# EAGLE design sanguish 3a pour (EAGLE 6.2)
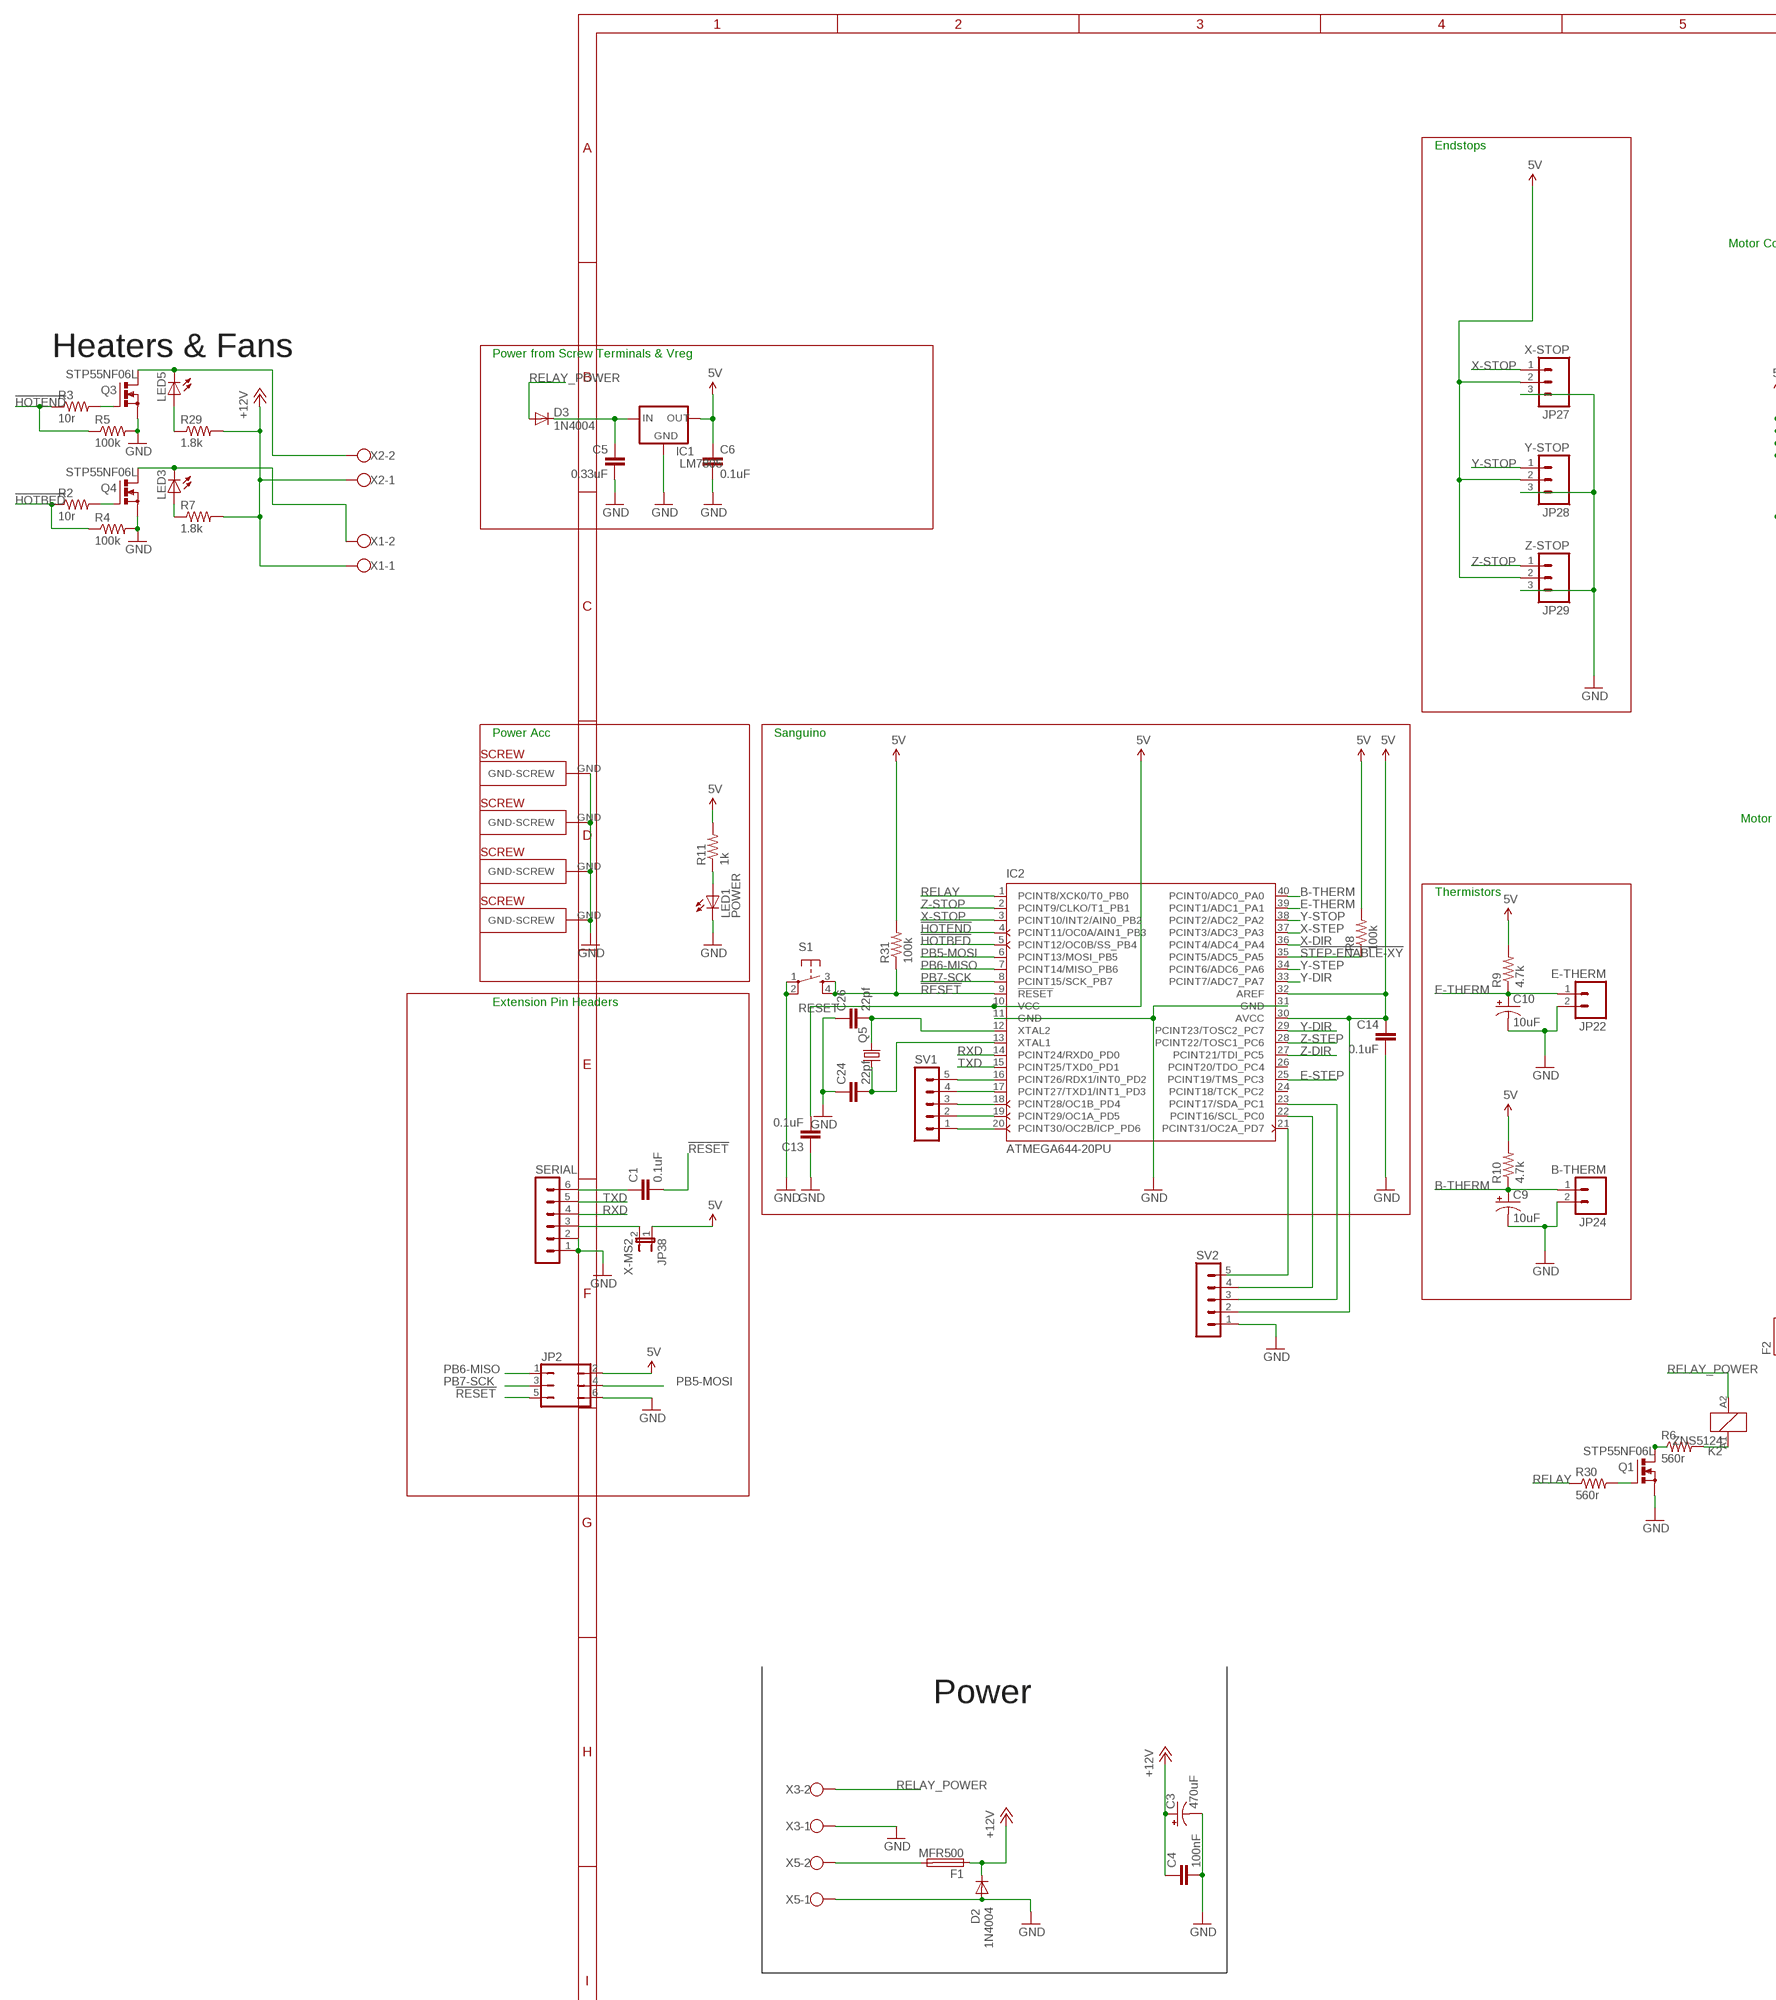
[diagram p0: schematic, sheet 1, part 1 of 2]
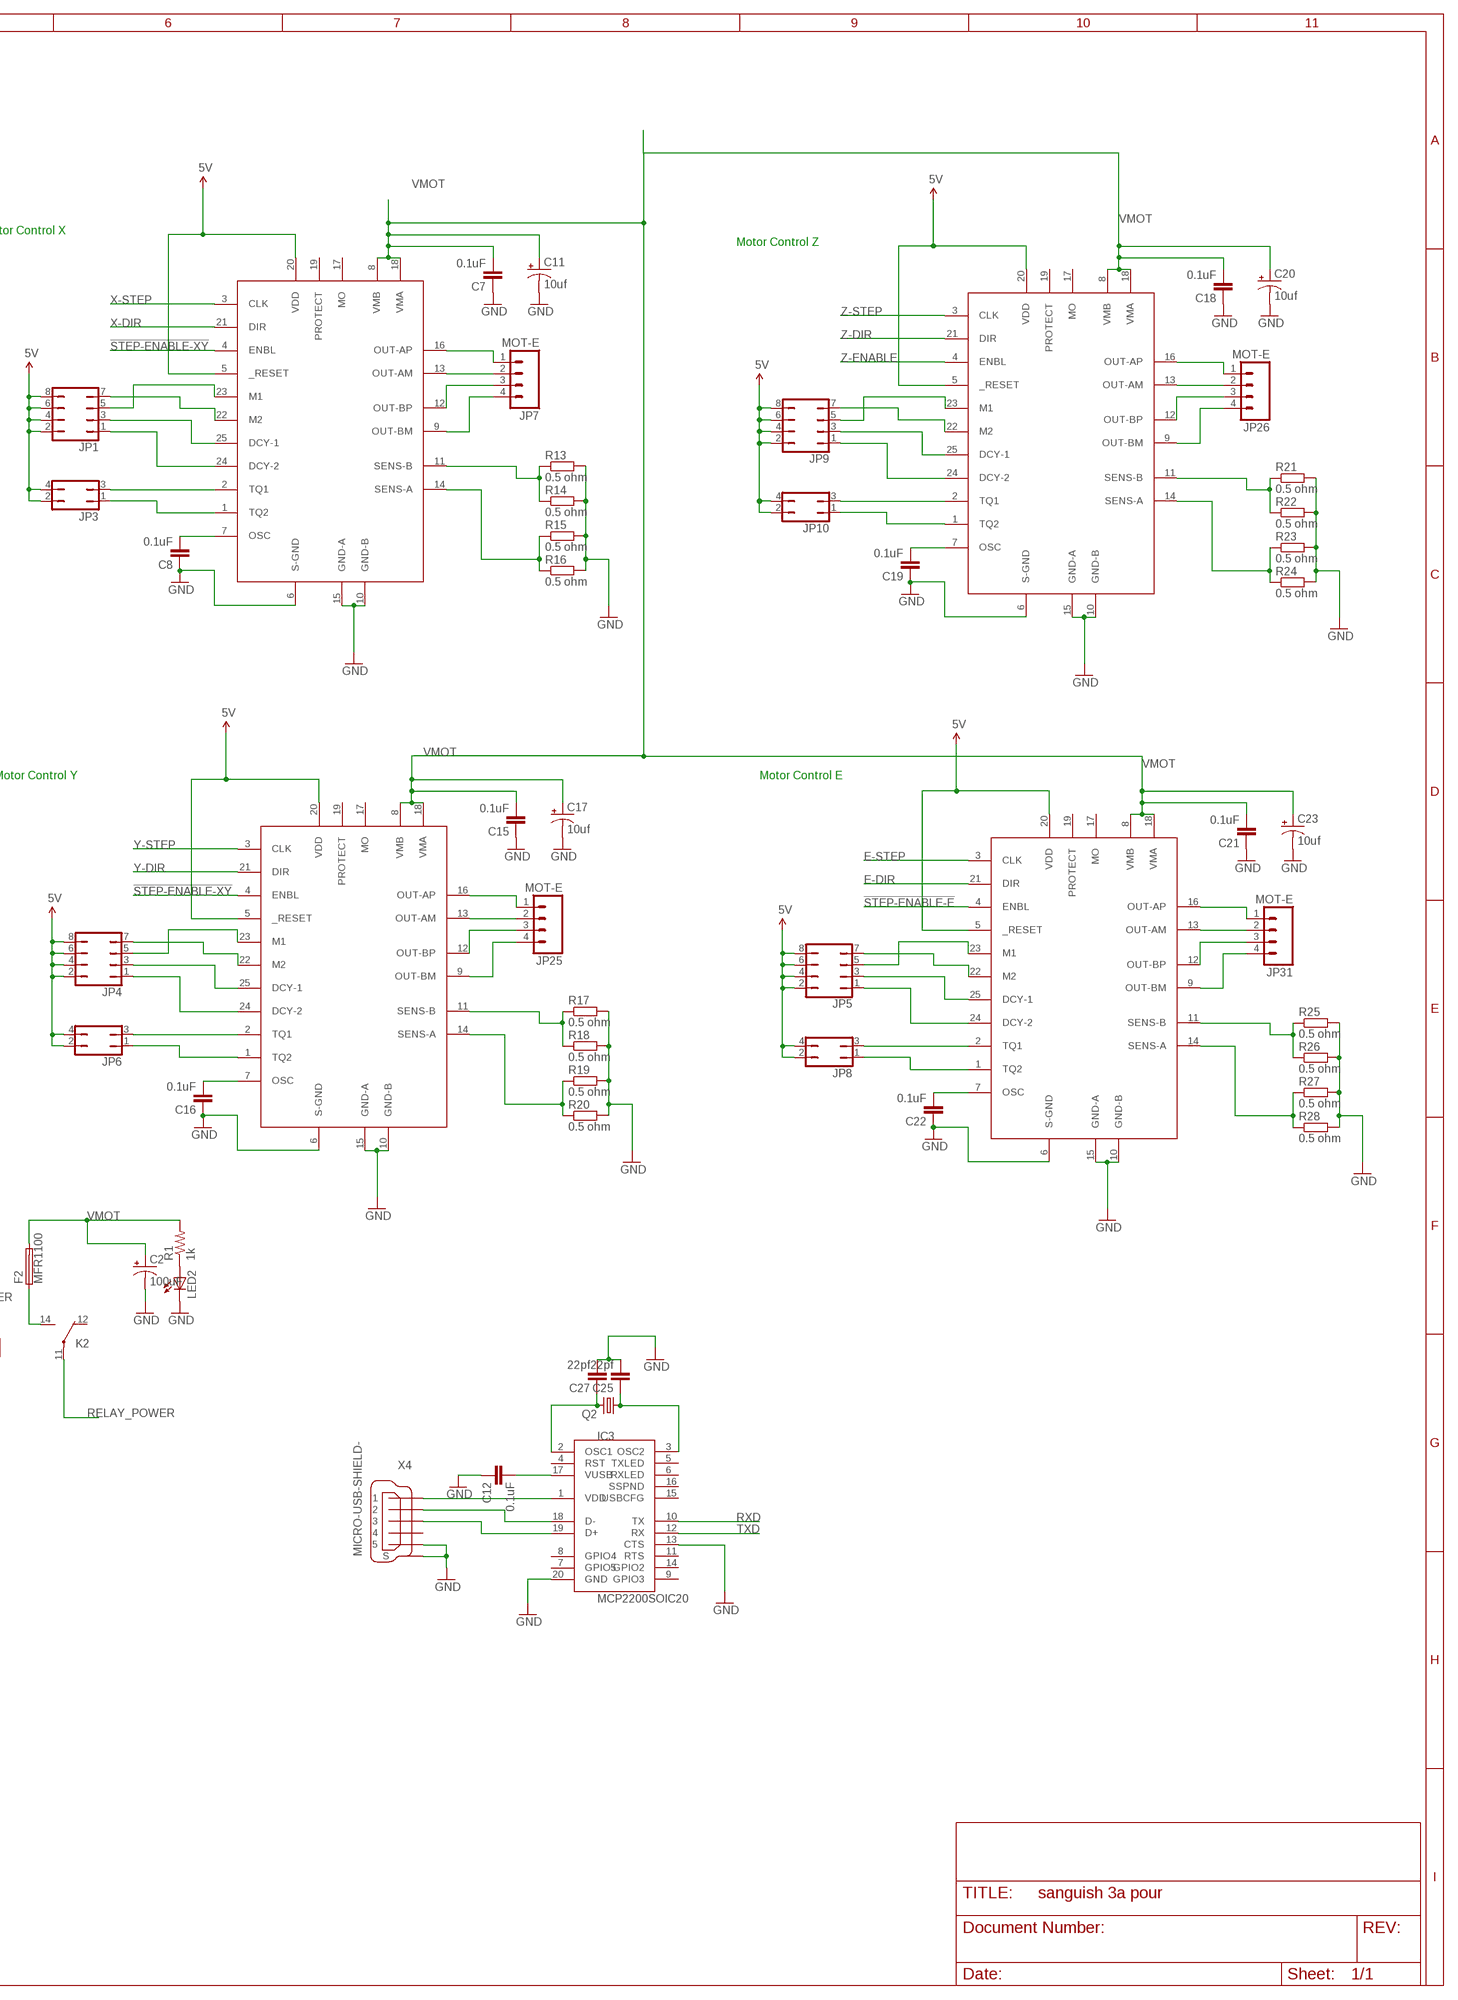
[diagram p1: schematic, sheet 1, part 2 of 2]

## Parts
C1  0.1uF  CAPPTH2  [CAP-PTH-SMALL2]
C2  100uF  CAP_POLPTH2  [CPOL-RADIAL-10UF-25V]
C3  470uF  CPOL-USE3.5-8  [E3,5-8]
C4  100nF  C2,5-3  [C2.5-3]
C5  0.33uF  CAPPTH2  [CAP-PTH-SMALL2]
C6  0.1uF  CAPPTH2  [CAP-PTH-SMALL2]
C7  0.1uF  CAPPTH2  [CAP-PTH-SMALL2]
C8  0.1uF  CAPPTH2  [CAP-PTH-SMALL2]
C9  10uF  CAP_POLPTH2  [CPOL-RADIAL-10UF-25V]
C10  10uF  CAP_POLPTH2  [CPOL-RADIAL-10UF-25V]
C11  10uf  CAP_POLPTH1  [CPOL-RADIAL-100UF-25V]
C12  0.1uF  CAPPTH2  [CAP-PTH-SMALL2]
C13  0.1uF  CAPPTH2  [CAP-PTH-SMALL2]
C14  0.1uF  CAPPTH2  [CAP-PTH-SMALL2]
C15  0.1uF  CAPPTH2  [CAP-PTH-SMALL2]
C16  0.1uF  CAPPTH2  [CAP-PTH-SMALL2]
C17  10uf  CAP_POLPTH1  [CPOL-RADIAL-100UF-25V]
C18  0.1uF  CAPPTH2  [CAP-PTH-SMALL2]
C19  0.1uF  CAPPTH2  [CAP-PTH-SMALL2]
C20  10uf  CAP_POLPTH1  [CPOL-RADIAL-100UF-25V]
C21  0.1uF  CAPPTH2  [CAP-PTH-SMALL2]
C22  0.1uF  CAPPTH2  [CAP-PTH-SMALL2]
C23  10uf  CAP_POLPTH1  [CPOL-RADIAL-100UF-25V]
C24  22pf  CAPPTH2  [CAP-PTH-SMALL2]
C25  22pf  CAPPTH2  [CAP-PTH-SMALL2]
C26  22pf  CAPPTH2  [CAP-PTH-SMALL2]
C27  22pf  CAPPTH2  [CAP-PTH-SMALL2]
D2  1N4004  [DO41-10]
D3  1N4004  [DO41-10]
F1  MFR500  PTCFUSE  [MFR500]
F2  MFR1100  PTCFUSEMFR1100  [MFR1100]
IC1  LM7805  V_REG_78XX  [78XXL-CUSTOM]
IC2  ATMEGA644-20PU  [DIL40]
IC3  MCP2200SOIC20  [SOIC20]
JP1  JP4Q  [JP4Q]
JP2  JP3Q  [JP3Q]
JP3  JP2Q  [JP2Q]
JP4  JP4Q  [JP4Q]
JP5  JP4Q  [JP4Q]
JP6  JP2Q  [JP2Q]
JP7  MOT-E  M04POLAR  [MOLEX-1X4]
JP8  JP2Q  [JP2Q]
JP9  JP4Q  [JP4Q]
JP10  JP2Q  [JP2Q]
JP22  E-THERM  M02PTH  [1X02]
JP24  B-THERM  M02PTH  [1X02]
JP25  MOT-E  M04POLAR  [MOLEX-1X4]
JP26  MOT-E  M04POLAR  [MOLEX-1X4]
JP27  X-STOP  M03POLAR  [MOLEX-1X3]
JP28  Y-STOP  M03POLAR  [MOLEX-1X3]
JP29  Z-STOP  M03POLAR  [MOLEX-1X3]
JP31  MOT-E  M04POLAR  [MOLEX-1X4]
JP38  X-MS2  JUMPER-2PTH  [1X02]
K2  ZNS5124  [ZN5]
LED1  POWER  LED3MM  [LED3MM]
LED2  LED3MM  [LED3MM]
LED3  LED3MM  [LED3MM]
LED5  LED3MM  [LED3MM]
Q1  STP55NF06L  IRF512  [TO220BV]
Q2  CRYSTALHC49S  [HC49/S]
Q3  STP55NF06L  IRF512  [TO220BV]
Q4  STP55NF06L  IRF512  [TO220BV]
Q5  CRYSTALHC49S  [HC49/S]
R1  1k  R-US_0207/2V  [0207/2V]
R2  10r  R-US_0207/2V  [0207/2V]
R3  10r  R-US_0207/2V  [0207/2V]
R4  100k  R-US_0207/2V  [0207/2V]
R5  100k  R-US_0207/2V  [0207/2V]
R6  560r  R-US_0207/2V  [0207/2V]
R7  1.8k  R-US_0207/2V  [0207/2V]
R8  100k  R-US_0207/2V  [0207/2V]
R9  4.7k  R-US_0207/2V  [0207/2V]
R10  4.7k  R-US_0207/2V  [0207/2V]
R11  1k  R-US_0207/2V  [0207/2V]
R13  0.5 ohm  R-EU_0207/10  [0207/10]
R14  0.5 ohm  R-EU_0207/10  [0207/10]
R15  0.5 ohm  R-EU_0207/10  [0207/10]
R16  0.5 ohm  R-EU_0207/10  [0207/10]
R17  0.5 ohm  R-EU_0207/10  [0207/10]
R18  0.5 ohm  R-EU_0207/10  [0207/10]
R19  0.5 ohm  R-EU_0207/10  [0207/10]
R20  0.5 ohm  R-EU_0207/10  [0207/10]
R21  0.5 ohm  R-EU_0207/10  [0207/10]
R22  0.5 ohm  R-EU_0207/10  [0207/10]
R23  0.5 ohm  R-EU_0207/10  [0207/10]
R24  0.5 ohm  R-EU_0207/10  [0207/10]
R25  0.5 ohm  R-EU_0207/10  [0207/10]
R26  0.5 ohm  R-EU_0207/10  [0207/10]
R27  0.5 ohm  R-EU_0207/10  [0207/10]
R28  0.5 ohm  R-EU_0207/10  [0207/10]
R29  1.8k  R-US_0207/2V  [0207/2V]
R30  560r  R-US_0207/2V  [0207/2V]
R31  100k  R-US_0207/2V  [0207/2V]
S1  RESET  TAC_SWITCHPTH  [TACTILE-PTH]
SERIAL  MA06-1  [MA06-1]
SV1  MA05-1  [MA05-1]
SV2  MA05-1  [MA05-1]
U$7  PLATED-SCREW  [PLATEDSCREW]
U$17  PLATED-SCREW  [PLATEDSCREW]
U$21  TB6560  [ZIP25]
U$37  PLATED-SCREW  [PLATEDSCREW]
U$38  PLATED-SCREW  [PLATEDSCREW]
U$43  TB6560  [ZIP25]
U$46  TB6560  [ZIP25]
X1  W237-102  [W237-102]
X2  W237-102  [W237-102]
X3  W237-102  [W237-102]
X4  MICRO-USB-SHIELD-  [10118192-0001LF]
X5  W237-102  [W237-102]
XMOT  TB6560  [ZIP25]

## Nets
5V: C6.1 C13.2 C14.1 IC1.OUT IC2.10(VCC) IC2.30(AVCC) IC2.32(AREF) JP1.2 JP1.4 JP1.6 JP1.8 JP2.2 JP3.2 JP3.4 JP4.2 JP4.4 JP4.6 JP4.8 JP5.2 JP5.4 JP5.6 JP5.8 JP6.2 JP6.4 JP8.2 JP8.4 JP9.2 JP9.4 JP9.6 JP9.8 JP10.2 JP10.4 JP27.2 JP28.2 JP29.2 JP38.1 R8.2 R9.2 R10.2 R11.2 R31.2 SV2.2 U$21.5(_RESET) U$21.20(VDD) U$43.5(_RESET) U$43.20(VDD) U$46.5(_RESET) U$46.20(VDD) XMOT.5(_RESET) XMOT.20(VDD)
!HOTBED: IC2.5(PCINT12/OC0B/SS_PB4) R2.1 R4.1
!HOTEND: IC2.4(PCINT11/OC0A/AIN1_PB3) R3.1 R5.1
!RESET: C1.2 IC2.9(!RESET) JP2.5 R31.1 S1.3 S1.4
!STEP-ENABLE-E: U$46.4(ENBL)
!STEP-ENABLE-XY: IC2.35(PCINT5/ADC5_PA5) R8.1 U$21.4(ENBL) XMOT.4(ENBL)
+12V: C3.+ C4.1 D2.C F1.1 R7.2 R29.2 X1.1 X2.1
B-THERM: C9.1(+) IC2.40(PCINT0/ADC0_PA0) JP24.1 R10.1
E-DIR: U$46.21(DIR)
E-STEP: IC2.25(PCINT19/TMS_PC3) U$46.3(CLK)
E-THERM: C10.1(+) IC2.39(PCINT1/ADC1_PA1) JP22.1 R9.1
GND [Power]: C2.2(-) C3.- C4.2 C5.2 C6.2 C7.1 C8.1 C9.2(-) C10.2(-) C11.2(-) C12.1 C13.1 C14.2 C15.1 C16.1 C17.2(-) C18.1 C19.1 C20.2(-) C21.1 C22.1 C23.2(-) C24.1 C25.2 C26.1 C27.2 D2.A IC1.GND IC2.11(GND) IC2.31(GND) IC3.13(CTS) IC3.20(GND) JP2.6 JP22.2 JP24.2 JP27.3 JP28.3 JP29.3 LED1.K(C) LED2.K(C) Q1.S Q3.S Q4.S R4.2 R5.2 R13.2 R14.2 R15.2 R16.2 R17.2 R18.2 R19.2 R20.2 R21.2 R22.2 R23.2 R24.2 R25.2 R26.2 R27.2 R28.2 S1.1 S1.2 SERIAL.1 SERIAL.2 SV2.1 U$7.GND(GND-SCREW) U$17.GND(GND-SCREW) U$21.6(S-GND) U$21.10(GND-B) U$21.15(GND-A) U$37.GND(GND-SCREW) U$38.GND(GND-SCREW) U$43.6(S-GND) U$43.10(GND-B) U$43.15(GND-A) U$46.6(S-GND) U$46.10(GND-B) U$46.15(GND-A) X3.1 X4.5 X4.M1(S) X4.M2(S) X4.M3(S) X4.M4(S) X4.M5(S) X4.M6(S) X5.1 XMOT.6(S-GND) XMOT.10(GND-B) XMOT.15(GND-A)
LED1: LED1.A R11.1
N$1: JP7.1 XMOT.16(OUT-AP)
N$2: JP25.1 U$21.16(OUT-AP)
N$3: JP7.2 XMOT.13(OUT-AM)
N$4: JP7.3 XMOT.12(OUT-BP)
N$5: JP7.4 XMOT.9(OUT-BM)
N$6: JP5.7 U$46.22(M2)
N$7: JP1.7 XMOT.22(M2)
N$8: JP1.3 XMOT.25(DCY-1)
N$9: JP1.1 XMOT.24(DCY-2)
N$10: JP10.3 U$43.2(TQ1)
N$11: JP3.1 XMOT.1(TQ2)
N$12: JP5.5 U$46.23(M1)
N$13: JP25.2 U$21.13(OUT-AM)
N$14: JP25.3 U$21.12(OUT-BP)
N$15: R13.1 R14.1 XMOT.11(SENS-B)
N$16: R15.1 R16.1 XMOT.14(SENS-A)
N$17: JP25.4 U$21.9(OUT-BM)
N$18: JP9.7 U$43.22(M2)
N$19: C8.2 XMOT.7(OSC)
N$20: JP4.7 U$21.22(M2)
N$21: JP4.3 U$21.25(DCY-1)
N$22: JP4.1 U$21.24(DCY-2)
N$23: JP9.5 U$43.23(M1)
N$24: JP8.3 U$46.2(TQ1)
N$25: JP5.3 U$46.25(DCY-1)
N$26: R17.1 R18.1 U$21.11(SENS-B)
N$27: R19.1 R20.1 U$21.14(SENS-A)
N$28: C16.2 U$21.7(OSC)
N$29: JP26.1 U$43.16(OUT-AP)
N$30: JP26.2 U$43.13(OUT-AM)
N$31: JP26.3 U$43.12(OUT-BP)
N$32: JP26.4 U$43.9(OUT-BM)
N$33: JP5.1 U$46.24(DCY-2)
N$34: JP6.3 U$21.2(TQ1)
N$35: JP8.1 U$46.1(TQ2)
N$36: JP3.3 XMOT.2(TQ1)
N$37: JP4.5 U$21.23(M1)
N$38: JP1.5 XMOT.23(M1)
N$39: JP9.3 U$43.25(DCY-1)
N$40: R21.1 R22.1 U$43.11(SENS-B)
N$41: R23.1 R24.1 U$43.14(SENS-A)
N$42: C19.2 U$43.7(OSC)
N$43: JP31.1 U$46.16(OUT-AP)
N$44: JP31.2 U$46.13(OUT-AM)
N$45: JP31.3 U$46.12(OUT-BP)
N$46: JP31.4 U$46.9(OUT-BM)
N$47: JP9.1
N$48: LED2.A R1.1
N$49: JP10.1
N$50: IC2.16(PCINT26/RDX1/INT0_PD2) SV1.5
N$51: IC2.17(PCINT27/TXD1/INT1_PD3) SV1.4
N$52: IC2.18(PCINT28/OC1B_PD4) SV1.3
N$53: IC2.19(PCINT29/OC1A_PD5) SV1.2
N$54: R25.1 R26.1 U$46.11(SENS-B)
N$55: R27.1 R28.1 U$46.14(SENS-A)
N$56: C22.2 U$46.7(OSC)
N$57: LED3.K(C) Q4.D X1.2
N$58: IC2.20(PCINT30/OC2B/ICP_PD6) SV1.1
N$59: LED5.K(C) Q3.D X2.2
N$60: Q4.G R2.2
N$61: Q3.G R3.2
N$62: IC2.21(PCINT31/OC2A_PD7)
N$63: IC2.22(PCINT16/SCL_PC0) SV2.4
N$64: LED3.A R7.1
N$65: LED5.A R29.1
N$66: Q1.D R6.1
N$67: Q1.G R30.2
N$68: C5.1 D3.C IC1.IN
N$69: IC2.23(PCINT17/SDA_PC1) SV2.3
N$70: C1.1 SERIAL.6
N$71: JP38.2 SERIAL.3
N$72: F2.1 K2.14(2:S)
N$73: K2.A1 R6.2
N$74: F1.2 X5.2
N$75: C12.2 IC3.17(VUSB)
N$76: JP6.1 U$21.1(TQ2)
N$77: IC3.1(VDD) X4.1
N$78: IC3.18(D-) X4.2
N$79: IC3.19(D+) X4.3
N$80: C26.2 IC2.12(XTAL2) Q5.2
N$81: C24.2 IC2.13(XTAL1) Q5.1
N$82: C27.1 IC3.2(OSC1) Q2.2
N$83: C25.1 IC3.3(OSC2) Q2.1
PB5-MOSI: IC2.6(PCINT13/MOSI_PB5) JP2.4
PB6-MISO: IC2.7(PCINT14/MISO_PB6) JP2.1
PB7-SCK: IC2.8(PCINT15/SCK_PB7) JP2.3
RELAY: IC2.1(PCINT8/XCK0/T0_PB0) R30.1
RELAY_POWER: D3.A K2.11(2:P) K2.A2 X3.2
RXD: IC2.14(PCINT24/RXD0_PD0) IC3.10(TX) SERIAL.4
TXD: IC2.15(PCINT25/TXD0_PD1) IC3.12(RX) SERIAL.5
VMOT: C2.1(+) C7.2 C11.1(+) C15.2 C17.1(+) C18.2 C20.1(+) C21.2 C23.1(+) F2.2 R1.2 U$21.8(VMB) U$21.18(VMA) U$43.8(VMB) U$43.18(VMA) U$46.8(VMB) U$46.18(VMA) XMOT.8(VMB) XMOT.18(VMA)
X-DIR: IC2.36(PCINT4/ADC4_PA4) XMOT.21(DIR)
X-STEP: IC2.37(PCINT3/ADC3_PA3) XMOT.3(CLK)
X-STOP: IC2.3(PCINT10/INT2/AIN0_PB2) JP27.1
Y-DIR: IC2.29(PCINT23/TOSC2_PC7) IC2.33(PCINT7/ADC7_PA7) U$21.21(DIR)
Y-STEP: IC2.34(PCINT6/ADC6_PA6) U$21.3(CLK)
Y-STOP: IC2.38(PCINT2/ADC2_PA2) JP28.1
Z-DIR: IC2.27(PCINT21/TDI_PC5) U$43.21(DIR)
Z-ENABLE: U$43.4(ENBL)
Z-STEP: IC2.28(PCINT22/TOSC1_PC6) U$43.3(CLK)
Z-STOP: IC2.2(PCINT9/CLKO/T1_PB1) JP29.1
Unconnected: IC2.24(PCINT18/TCK_PC2) IC2.26(PCINT20/TDO_PC4) IC3.4(RST) IC3.5(TXLED) IC3.6(RXLED) IC3.7(GPIO5) IC3.8(GPIO4) IC3.9(GPIO3) IC3.11(RTS) IC3.14(GPIO2) IC3.15(USBCFG) IC3.16(SSPND) K2.12(2:O) SV2.5 U$21.17(MO) U$21.19(PROTECT) U$43.1(TQ2) U$43.17(MO) U$43.19(PROTECT) U$43.24(DCY-2) U$46.17(MO) U$46.19(PROTECT) X4.4 XMOT.17(MO) XMOT.19(PROTECT)

## Notes on the sheet
- Endstops
- Motor Control X
- Motor Control Z
- Heaters & Fans | Power from Screw Terminals & Vreg
- Power Acc | Sanguino
- Motor Control Y | Motor Control E
- Thermistors
- Extension Pin Headers
- Power

## Library data of the parts
C1 C5-C8 C12-C16 C18 C19 C21 C22 C24-C27 = SparkFun:CAP: Capacitor Standard 0603 ceramic capacitor, and 0.1" leaded capacitor.
C2 C9-C11 C17 C20 C23 = SparkFun:CAP_POL: Capacitor Polarized These are standard SMD and PTH capacitors. Normally 10uF, 47uF, and 100uF in electrolytic and tantalum varieties. Always verify the external diameter of the through hole cap, it varies with capacity, voltage, and manufacturer. The EIA devices should be standard.
C3 = adafruit:CPOL-US: POLARIZED CAPACITOR, American symbol
C4 = capacitor-wima:C: CAPACITOR naming: grid - package width
D2 D3 = diode:1N4004: DIODE general purpose rectifier, 1 A
F1 F2 = RepRapjr:PTCFUSE: LITTLEFUSE Picofuse/slow Littlefuse
IC1 = SparkFun:V_REG_78XX: Voltage Regulator Standard 7805 5V regulator. IGO (Input Ground Output). Spark Fun Electronics SKU : COM-00107
IC2 = atmel:ATMEGA644-*PU: 8-bit Microcontroller with 64K Bytes In-System Programmable Flash Auto generated by make-symbol-device-package-bsdl.ulp Rev. 34 Source: http://www.atmel.com/dyn/resources/prod_documents/doc2593.pdf; MPN: ATMEGA644-20PU; OC_FARNELL: 1288340; OC_NEWARK: 23M5060
IC3 = microchip-update-2:MCP2200: USB 2.0 to UART Protocol Converter with GPIO
JP1 JP4 JP5 JP9 = jumper:JP4Q: JUMPER
JP2 = jumper:JP3Q: JUMPER
JP3 JP6 JP8 JP10 = jumper:JP2Q: JUMPER
JP7 JP25 JP26 JP31 = SparkFun:M04: Header 4 Standard 4-pin 0.1" header. Use with straight break away headers (SKU : PRT-00116), right angle break away headers (PRT-00553), swiss pins (PRT-00743), machine pins (PRT-00117), and female headers (PRT-00115). Molex polarized connector foot print use with SKU : PRT-08231 with associated crimp pins and housings.
JP22 JP24 = SparkFun:M02: Header 2 Standard 2-pin 0.1" header. Use with straight break away headers (SKU : PRT-00116), right angle break away headers (PRT-00553), swiss pins (PRT-00743), machine pins (PRT-00117), and female headers (PRT-00115). Molex polarized connector foot print use with SKU : PRT-08233 with associated crimp pins and housings.
JP27-JP29 = SparkFun:M03: Header 3 Standard 3-pin 0.1" header. Use with straight break away headers (SKU : PRT-00116), right angle break away headers (PRT-00553), swiss pins (PRT-00743), machine pins (PRT-00117), and female headers (PRT-00115). Molex polarized connector foot print use with SKU : PRT-08232 with associated crimp pins and housings.
JP38 = SparkFun:JUMPER-2: Jumper Basic 0.1" spaced jumper. Use with breakaway headers.
K2 = relay:ZNS5*: Miniature Power PCB Relay SCHRACK 1pole 10 A Source: http://www.schrack.com/.. 5847.pdf; OC_FARNELL: unknown; OC_NEWARK: unknown
LED1 = SparkFun:LED: LEDs Standard schematic elements and footprints for 5mm, 3mm, 1206, and 0603 sized LEDs. 5mm - Spark Fun Electronics SKU : COM-00529 (and others)
LED2 LED3 LED5 = led:LED: LED OSRAM: - CHIPLED LG R971, LG N971, LY N971, LG Q971, LY Q971, LO R971, LY R971 LH N974, LH R974 LS Q976, LO Q976, LY Q976 LO Q996 - Hyper CHIPLED LW Q18S LB Q993, LB Q99A, LB R99A - SideLED LS A670, LO A670, LY A670, LG A670, LP A670 LB A673, LV A673, LT A673, LW A673 LH A674 LY A675 LS A676, LA A676, LO A676, LY A676, LW A676 LS A679, LY A679, LG A679 - Hyper Micro SIDELED® LS Y876, LA Y876, LO Y876, LY Y876 LT Y87S - SmartLED LW L88C, LW L88S LB L89C, LB L89S, LG L890 LS L89K, LO L89K, LY L89K LS L896, LA L896, LO L896, LY L896 - TOPLED LS T670, LO T670, LY T670, LG T670, LP T670 LSG T670, LSP T670, LSY T670, LOP T670, LYG T670 LG T671, LOG T671, LSG T671 LB T673, LV T673, LT T673, LW T673 LH T674 LS T676, LA T676, LO T676, LY T676, LB T676, LH T676, LSB T676, LW T676 LB T67C, LV T67C, LT T67C, LS T67K, LO T67K, LY T67K, LW E67C LS E67B, LA E67B, LO E67B, LY E67B, LB E67C, LV E67C, LT E67C LW T67C LS T679, LY T679, LG T679 LS T770, LO T770, LY T770, LG T770, LP T770 LB T773, LV T773, LT T773, LW T773 LH T774 LS E675, LA E675, LY E675, LS T675 LS T776, LA T776, LO T776, LY T776, LB T776 LHGB T686 LT T68C, LB T68C - Hyper Mini TOPLED® LB M676 - Mini TOPLED Santana® LG M470 LS M47K, LO M47K, LY M47K Source: http://www.osram.convergy.de LUXEON: - LUMILED® LXK2-PW12-R00, LXK2-PW12-S00, LXK2-PW14-U00, LXK2-PW14-V00 LXK2-PM12-R00, LXK2-PM12-S00, LXK2-PM14-U00 LXK2-PE12-Q00, LXK2-PE12-R00, LXK2-PE12-S00, LXK2-PE14-T00, LXK2-PE14-U00 LXK2-PB12-K00, LXK2-PB12-L00, LXK2-PB12-M00, LXK2-PB14-N00, LXK2-PB14-P00, LXK2-PB14-Q00 LXK2-PR12-L00, LXK2-PR12-M00, LXK2-PR14-Q00, LXK2-PR14-R00 LXK2-PD12-Q00, LXK2-PD12-R00, LXK2-PD12-S00 LXK2-PH12-R00, LXK2-PH12-S00 LXK2-PL12-P00, LXK2-PL12-Q00, LXK2-PL12-R00 Source: www.luxeon.com KINGBRIGHT: KA-3528ASYC Source: www.kingbright.com
Q1 Q3 Q4 = transistor-power:IRF512: N-CHANNEL MOS FET
Q2 Q5 = crystal:CRYSTAL: CRYSTAL; OC_FARNELL: 1667008; OC_NEWARK: unknown
R1-R11 R29-R31 = resistor:R-US_: RESISTOR, American symbol
R13-R28 = resistor:R-EU_: RESISTOR, European symbol
S1 = SparkFun:TAC_SWITCH: Momentary Switch Button commonly used for reset or general input. Spark Fun Electronics SKU : COM-00097
SERIAL = con-lstb:MA06-1: PIN HEADER; OC_FARNELL: unknown; OC_NEWARK: unknown
SV1 SV2 = con-lstb:MA05-1: PIN HEADER; OC_FARNELL: unknown; OC_NEWARK: unknown
U$7 U$17 U$37 U$38 = Sanguinololu:PLATED-SCREW
U$21 U$43 U$46 XMOT = tb6560:TB6560
X1-X3 X5 = con-wago-500:W237-102: WAGO SCREW CLAMP; MPN: 237-102; OC_FARNELL: unknown; OC_NEWARK: 70K9898
X4 = shinythings:MICRO-USB-SHIELD-: MINI USB Connector Source: http://www.hirose.co.jp/cataloge_hp/e24000019.pdf

## Net classes
0 default: width 0.178 mm, drill 0.406 mm, clearance 0.178 mm
1 Power: width 0.3 mm, drill 0.406 mm, clearance 0.178 mm

## Board
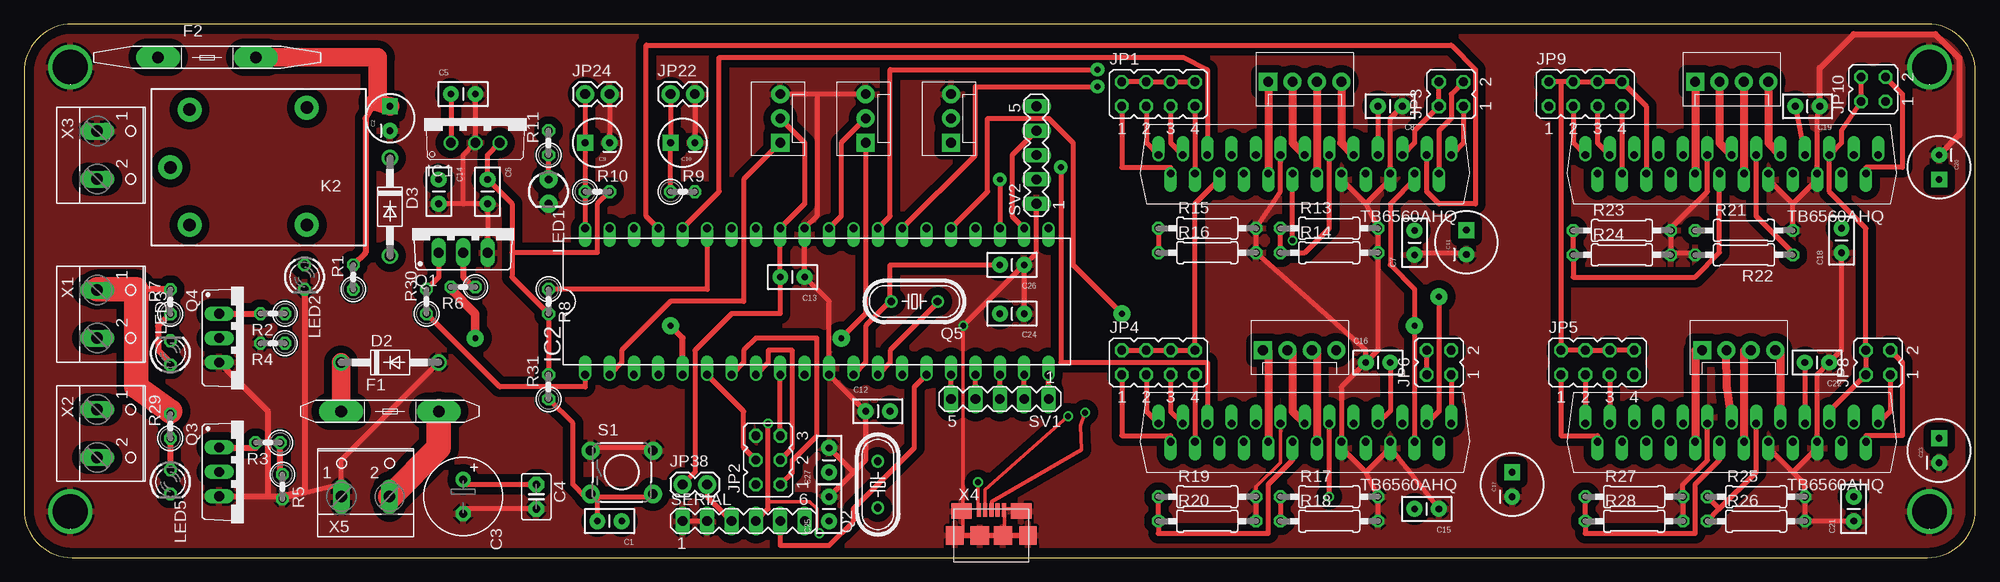
[diagram p2: board, top side]
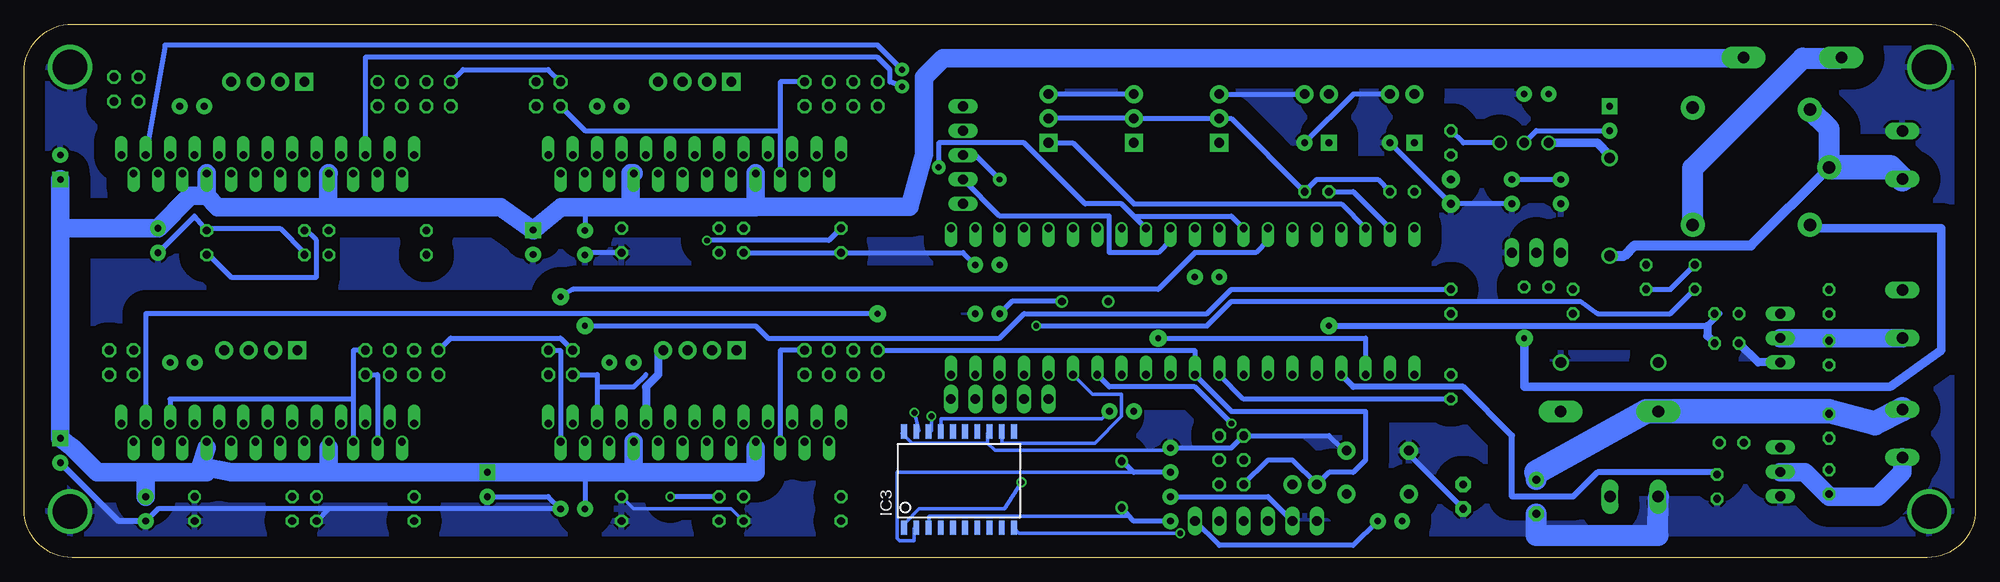
[diagram p3: board, bottom side, seen from below]

Size 203.18 x 55.55 mm. Coordinates in mm from the lower left corner, seen from the top.
Outline: 0,50.55 0,5 arc90 5,0 198.18,0 arc90 203.18,5 203.18,50.55 arc90 198.18,55.55 5,55.55 arc90 0,50.55
Copper layers (1*16): Top 0.035mm / dielectric 1.5mm / Bottom 0.035mm
Design rules: minimum track width 35mil, minimum drill 24mil, track to track 8mil, track to pad 8mil, pad to pad 8mil, via to via 8mil, smd to smd 8mil, copper to edge 40mil, drill to drill 8mil, minimum pad ring 10mil, minimum via ring 8mil, stop-mask expansion 4mil, vias tented up to drill 0mil, thermal gap 10mil

### Footprints (pad centres in the part's own frame; a part is rotated, then mirrored left to right if it is on the bottom)
CAP-PTH-SMALL2 = drill 0.7 pad 1.651: 1 0,0; 2 2.54,0
CPOL-RADIAL-10UF-25V = drill 0.7 pad 1.651 square: 1 1.27,0 | drill 0.7 pad 1.651: 2 -1.27,0
E3,5-8 = drill 0.813 pad 1.6: + -1.778,0 | drill 0.813 pad 1.6 octagon: - 1.778,0
C2.5-3 = drill 0.813 pad 1.6 octagon: 1 -1.27,0; 2 1.27,0
CPOL-RADIAL-100UF-25V = drill 0.7 pad 1.651 square: 1 1.27,0 | drill 0.7 pad 1.651: 2 -1.27,0
DO41-10 = drill 1.118: A 5.08,0; C -5.08,0
MFR500 = drill 1.2 pad 2.3 long: 1 -5.08,0; 2 5.08,0
MFR1100 = drill 1.2 pad 2.3 long: 1 -5.08,0; 2 5.08,0
78XXL-CUSTOM = drill 1.016: GND 0,0; IN -2.54,0; OUT 2.54,0
DIL40 = drill 0.813 offset: 1 -24.13,-7.62; 2 -21.59,-7.62; 3 -19.05,-7.62; 4 -16.51,-7.62; 5 -13.97,-7.62; 6 -11.43,-7.62; 7 -8.89,-7.62; 8 -6.35,-7.62; 9 -3.81,-7.62; 10 -1.27,-7.62; 11 1.27,-7.62; 12 3.81,-7.62; 13 6.35,-7.62; 14 8.89,-7.62; 15 11.43,-7.62; 16 13.97,-7.62; 17 16.51,-7.62; 18 19.05,-7.62; 19 21.59,-7.62; 20 24.13,-7.62; 21 24.13,7.62; 22 21.59,7.62; 23 19.05,7.62; 24 16.51,7.62; 25 13.97,7.62; 26 11.43,7.62; 27 8.89,7.62; 28 6.35,7.62; 29 3.81,7.62; 30 1.27,7.62; 31 -1.27,7.62; 32 -3.81,7.62; 33 -6.35,7.62; 34 -8.89,7.62; 35 -11.43,7.62; 36 -13.97,7.62; 37 -16.51,7.62; 38 -19.05,7.62; 39 -21.59,7.62; 40 -24.13,7.62
SOIC20 = smd 0.6 x 1.5: 1 -5.715,-5; 2 -4.445,-5; 3 -3.175,-5; 4 -1.905,-5; 5 -0.635,-5; 6 0.635,-5; 7 1.905,-5; 8 3.175,-5; 9 4.445,-5; 10 5.715,-5; 11 5.715,5; 12 4.445,5; 13 3.175,5; 14 1.905,5; 15 0.635,5; 16 -0.635,5; 17 -1.905,5; 18 -3.175,5; 19 -4.445,5; 20 -5.715,5
JP4Q = drill 0.914 octagon: 1 -3.81,-1.27; 2 -3.81,1.27; 3 -1.27,-1.27; 4 -1.27,1.27; 5 1.27,-1.27; 6 1.27,1.27; 7 3.81,-1.27; 8 3.81,1.27
JP3Q = drill 0.914 octagon: 1 -2.54,-1.27; 2 -2.54,1.27; 3 0,-1.27; 4 0,1.27; 5 2.54,-1.27; 6 2.54,1.27
JP2Q = drill 0.914 octagon: 1 -1.27,-1.27; 2 -1.27,1.27; 3 1.27,-1.27; 4 1.27,1.27
MOLEX-1X4 = drill 1.016 pad 1.88 square: 1 0,0 | drill 1.016 pad 1.88: 2 2.54,0; 3 5.08,0; 4 7.62,0
1X02 = drill 1.016 pad 1.88: 1 0,0; 2 2.54,0
MOLEX-1X3 = drill 1.016 pad 1.88 square: 1 0,0 | drill 1.016 pad 1.88: 2 2.54,0; 3 5.08,0
ZN5 = drill 1.3 pad 2.5: 11 8.89,0; 12 -5.31,-6.2; 14 -5.31,6; A1 6.89,6; A2 6.89,-6
LED3MM = drill 0.813 pad 1.88: A -1.27,0; K 1.27,0
LED3MM' = drill 0.813 octagon: A -1.27,0; K 1.27,0
TO220BV = drill 1.016 long: D 0,-2.54; G -2.54,-2.54; S 2.54,-2.54
HC49/S = drill 0.813: 1 -2.413,0; 2 2.413,0
0207/2V = drill 0.813 octagon: 1 -1.27,0; 2 1.27,0
0207/10 = drill 0.813 octagon: 1 -5.08,0; 2 5.08,0
TACTILE-PTH = drill 1.016 pad 1.88: 1 -3.251,2.261; 2 3.251,2.261; 3 -3.251,-2.261; 4 3.251,-2.261
MA06-1 = drill 1.016 long: 1 -6.35,0; 2 -3.81,0; 3 -1.27,0; 4 1.27,0; 5 3.81,0; 6 6.35,0
MA05-1 = drill 1.016 long: 1 -5.08,0; 2 -2.54,0; 3 0,0; 4 2.54,0; 5 5.08,0
PLATEDSCREW = drill 3.6: GND 0,0
ZIP25 = drill 0.8 pad 1.27 offset: 1 -15.24,0; 2 -13.97,1.905; 3 -12.7,0; 4 -11.43,1.905; 5 -10.16,0; 6 -8.89,1.905; 7 -7.62,0; 8 -6.35,1.905; 9 -5.08,0; 10 -3.81,1.905; 11 -2.54,0; 12 -1.27,1.905; 13 0,0; 14 1.27,1.905; 15 2.54,0; 16 3.81,1.905; 17 5.08,0; 18 6.35,1.905; 19 7.62,0; 20 8.89,1.905; 21 10.16,0; 22 11.43,1.905; 23 12.7,0; 24 13.97,1.905; 25 15.24,0
W237-102 = drill 1.194 long: 1 -2.5,-1.27; 2 2.5,-1.27
10118192-0001LF = smd 0.4 x 1.4: 1 -1.3,2.675; 2 -0.65,2.675; 3 0,2.675; 4 0.65,2.675; 5 1.3,2.675 | smd 1.8 x 1.9: M1 3.8,0; M2 -3.8,0 | smd 2.1 x 1.6: M3 -3.1,2.55; M4 3.1,2.55 | smd 1.9 x 1.9: M5 1.2,0; M6 -1.2,0

### Placement (x,y rotation side)
C1  62.23,3.81 180 top
C2  38.1,45.72 90 top
C3  45.72,6.35 270 top
C4  53.34,6.35 270 top
C5  44.45,48.26 0 top
C6  48.26,39.37 270 top
C7  144.78,31.52 90 top
C8  143.51,46.99 180 top
C9  59.69,43.18 180 top
C10  68.58,43.18 180 top
C11  150.17,32.83 90 top
C12  87.63,15.24 0 top
C13  81.28,29.21 180 top
C14  43.18,39.37 270 top
C15  147.32,5.08 180 top
C16  139.7,20.32 0 top
C17  154.94,7.62 90 top
C18  189.23,31.75 90 top
C19  186.96,46.99 180 top
C20  199.39,40.64 270 top
C21  190.5,3.81 90 top
C22  187.96,20.32 180 top
C23  199.39,11.16 90 top
C24  104.14,25.4 180 top
C25  83.82,3.81 90 top
C26  104.14,30.48 180 top
C27  83.82,8.89 90 top
D2  38.1,20.32 0 top
D3  38.1,36.52 270 top
F1  38.1,15.24 0 top
F2  19.05,52.07 0 top
IC1  46.99,43.18 0 top
IC2  82.55,26.67 0 top
IC3  105.83,8.12 0 bottom
JP1  118.11,48.26 0 top
JP2  77.47,10.16 90 top
JP3  148.59,48.26 90 top
JP4  118.11,20.32 0 top
JP5  163.83,20.32 0 top
JP6  147.32,20.32 90 top
JP7  129.54,49.53 0 top
JP8  193.04,20.32 90 top
JP9  162.56,48.26 0 top
JP10  192.54,48.76 90 top
JP22  67.31,48.26 0 top
JP24  58.42,48.26 0 top
JP25  129,21.59 0 top
JP26  173.99,49.53 0 top
JP27  87.63,43.18 90 top
JP28  96.52,43.18 90 top
JP29  78.74,43.18 90 top
JP31  174.72,21.59 0 top
JP38  68.58,7.62 0 top
K2  24.13,40.64 180 top
LED1  54.61,38.1 270 top
LED2  [LED3MM']  29.21,29.21 270 top
LED3  [LED3MM']  15.24,21.32 90 top
LED5  [LED3MM']  15.24,7.89 270 top
Q1  45.72,34.29 0 top
Q2  88.9,7.62 90 top
Q3  22.86,8.93 270 top
Q4  22.86,22.86 270 top
Q5  92.71,26.67 180 top
R1  34.29,29.21 90 top
R2  25.9,25.4 180 top
R3  25.4,11.97 180 top
R4  25.9,22.32 180 top
R5  26.9,7.39 270 top
R6  45.72,28.17 180 top
R7  15.24,26.63 90 top
R8  54.61,26.67 270 top
R9  68.58,38.1 0 top
R10  59.69,38.1 0 top
R11  54.61,43.18 90 top
R13  135.89,34.29 0 top
R14  135.89,31.75 0 top
R15  123.19,34.29 0 top
R16  123.19,31.75 0 top
R17  135.89,6.35 0 top
R18  135.89,3.81 0 top
R19  123.19,6.35 0 top
R20  123.19,3.81 0 top
R21  179.07,34.06 0 top
R22  179.07,31.52 180 top
R23  166.37,34.06 0 top
R24  166.37,31.52 0 top
R25  180.34,6.35 0 top
R26  180.34,3.81 0 top
R27  167.64,6.35 0 top
R28  167.64,3.81 0 top
R29  15.24,13.7 90 top
R30  41.91,26.67 90 top
R31  54.61,17.78 90 top
S1  62.23,8.89 0 top
SERIAL  74.93,3.81 0 top
SV1  101.6,16.51 180 top
SV2  105.41,41.91 90 top
U$7  198.39,4.81 0 top
U$17  4.81,51.07 0 top
U$21  133.35,13.97 180 top
U$37  4.81,4.81 0 top
U$38  198.39,51.07 0 top
U$43  177.8,41.91 180 top
U$46  177.8,13.97 180 top
X1  8.89,25.36 270 top
X2  8.89,12.93 270 top
X3  8.89,41.91 270 top
X4  100.72,2.31 0 top
X5  35.56,7.62 0 top
XMOT  133.35,41.91 180 top

### Tracks (layer width: path | path; a pad name or v marks a point on that pad's centre or on a via)
5V
  Top 0.508: R31.2 R8.2 50.8,29.21 50.8,31.75 | 50.8,31.75 50.8,36.83 C6.1 48.26,41.91 IC1.OUT | JP1.2 JP1.4 JP1.6 JP1.8 | IC2.30 85.09,35.56 85.09,43.18 JP27.2 | JP29.2 81.28,43.18 81.28,36.83 IC2.32 C13.2 78.74,25.4 73.66,25.4 69.85,21.59 69.85,8.89 JP38.1 | 50.8,31.75 59.69,31.75 59.69,36.83 R10.2 | JP4.2 JP4.4 JP4.6 JP4.8 121.92,36.83 124.46,39.37 XMOT.20 | XMOT.5 144.78,43.18 144.78,44.45 JP3.2 JP3.4 | 160.02,49.53 JP9.4 JP9.6 JP9.8 168.91,46.99 U$43.20 | 160.02,49.53 JP9.2 | JP10.4 JP10.2 189.23,44.45 189.23,43.18 U$43.5 187.96,38.1 191.77,34.29 JP8.4 JP8.2 187.96,15.24 U$46.5 | JP6.2 JP6.4 | JP5.8 JP5.6 JP5.4 JP5.2 160.02,49.53
  Bottom 0.508: R11.2 53.34,43.18 IC1.OUT | C6.1 C14.1 | JP2.2 73.66,10.16 71.12,10.16 JP38.1 67.31,8.89 64.77,8.89 63.5,10.16 63.5,15.24 77.47,15.24 IC2.10 81.28,21.59 JP4.2 | R10.2 62.23,39.37 68.58,39.37 R9.2 77.47,45.72 JP29.2 JP27.2 JP28.2 | U$21.20 124.46,21.59 JP4.8 | JP3.4 148.59,50.8 157.48,50.8 JP9.2 | 143.51,17.78 143.51,19.05 JP6.2 | 143.51,17.78 U$21.5 | 168.91,16.51 168.91,21.59 JP5.8 | 168.91,16.51 U$46.20 | U$46.5 187.96,16.51 168.91,16.51 | JP6.4 147.32,22.86 158.75,22.86 JP5.2 | 138.43,19.05 139.7,17.78 143.51,17.78 | SV2.2 101.6,35.56 90.17,35.56 90.17,31.75 85.09,31.75 83.82,33.02 IC2.30 | 124.46,44.45 124.46,49.53 JP1.8 | 124.46,44.45 XMOT.20 | 124.46,44.45 144.78,44.45 JP3.2
!HOTBED  (via drill 0.61 pad 1.78)
  Top 0.635: v67.31,24.13 68.58,22.86 IC2.5
  Bottom 0.635: v67.31,24.13 27.94,24.13 26.67,25.4 R2.1
  Bottom 0.813: 27.94,24.13 27.94,23.09 R4.1
!HOTEND
  Top 0.635: R3.1 26.67,8.89 R5.1
  Bottom 0.635: IC2.4 64.77,17.78 53.34,17.78 48.26,12.7 48.26,6.35 41.91,6.35 39.37,8.89 26.67,8.89 R5.1
!RESET
  Top 0.508: JP2.5 IC2.9 | R31.1 57.15,13.97 57.15,7.62 58.42,6.35 S1.3 59.69,6.35 | 59.69,6.35 C1.2 | 59.69,6.35 64.77,6.35 S1.4
  Bottom 0.508: IC2.9 76.2,16.51 R31.1
!STEP-ENABLE-XY  (via drill 0.61 pad 1.78)
  Top 0.508: R8.1 71.12,27.94 IC2.35 | U$21.4 v144.78,24.13 144.78,27.94 142.24,30.48 142.24,36.83 144.78,39.37 XMOT.4
  Bottom 0.508: R8.1 77.47,27.94 80.01,25.4 99.06,25.4 101.6,22.86 125.73,22.86 127,24.13 v144.78,24.13
+12V
  Top 0.508: C4.1 45.72,7.62 C3.+
  Top 0.635: 11.7,27.94 15.24,27.94 R7.2 | 7.62,27.94 X1.1 | 15.24,15.24 R29.2
  Top 1.93: F1.1 D2.C
  Top 2.54: 7.62,27.94 11.7,27.94 11.7,17.78 15.24,15.24
  Bottom 0.635: 15.24,15.24 R29.2
  Bottom 1.93: 7.62,15.47 X2.1
  Bottom 2.184: 45.72,8.89 C3.+
  Bottom 2.54: 45.72,8.89 34.29,15.24 F1.1 15.24,15.24 10.47,13.97 7.62,15.47
B-THERM
  Top 0.508: IC2.40 R10.1 C9.1 JP24.1
E-STEP  (via drill 0.61 pad 1.78)
  Top 0.508: v114.3,25.4 109.22,30.48 109.22,43.18 106.68,45.72 100.33,45.72 100.33,38.1 IC2.25
  Bottom 0.508: U$46.3 190.5,25.4 v114.3,25.4
E-THERM
  Top 0.508: JP22.1 C10.1 R9.1
  Bottom 0.508: IC2.39 64.77,38.1 R9.1
GND  (via drill 0.61)
  Top 0.381: U$21.15 130.81,9.91 128.27,7.37 R19.2 | X4.M2 97.79,2.54 97.79,4.83 X4.M3 97.79,5.08 v97.79,24.13 | X4.M4 103.63,5.08 102.11,5.08 X4.5 102.11,4.83 102.11,2.54 X4.M5
  Top 0.508: D2.A 33.02,10.16 33.02,7.62 | 33.02,7.62 33.02,6.35 X5.1 33.02,7.62 | 33.02,7.62 R5.2 | C4.2 45.72,5.08 C3.- | S1.1 59.69,11.43 64.77,11.43 S1.2 | SERIAL.2 SERIAL.1 | 86.36,8.89 87.63,10.16 C12.1 IC2.11 83.82,26.67 C13.1 IC2.31 82.55,35.56 82.55,48.26 | 86.36,8.89 C25.2 | 86.36,8.89 C27.2 | JP22.2 C10.2 | JP27.3 82.55,48.26 | 82.55,48.26 JP29.3 | C5.2 IC1.GND 45.72,41.91 45.72,36.83 | JP24.2 C9.2 | Q1.S C6.2 45.72,36.83 | 45.72,36.83 C14.2 | X4.M2 X4.M6 X4.M5 X4.M1 | C26.1 C24.1 | XMOT.15 130.81,38.1 R15.2 R16.2 139.7,21.59 C16.1 | 139.7,36.83 R13.2 R14.2 140.97,21.59 C16.1 | 139.7,36.83 137.16,39.37 XMOT.10 | 139.7,36.83 142.24,39.37 XMOT.6 142.24,45.72 C8.1 | 139.7,8.89 R17.2 R18.2 | 139.7,8.89 137.16,11.43 U$21.10 137.16,17.78 C16.1 | 139.7,8.89 142.24,11.43 | 142.24,11.43 C15.1 | 142.24,11.43 U$21.6 | 184.15,36.83 181.61,39.37 U$43.10 | R21.2 184.15,36.83 | 184.15,36.83 186.69,39.37 U$43.6 186.69,45.72 C19.1 | C18.1 189.23,21.59 C22.1 186.69,19.05 U$46.6 186.69,11.43 184.15,8.89 | C26.1 v97.79,24.13 | SV2.1 105.41,31.75 C26.1 | U$43.15 175.26,38.1 171.45,34.29 R23.2 171.45,31.75 | 171.45,31.75 173.99,31.75 R22.2 | 171.45,31.75 R24.2 | 184.15,8.89 185.42,7.62 R25.2 R26.2 C21.1 | 184.15,8.89 181.61,11.43 U$46.10 | U$46.15 175.26,10.16 172.72,7.62 R27.2 R28.2 | C11.2 149.86,31.75 144.78,31.75 C7.1 | R19.2 R20.2
  Top 0.61: C19.1 186.96,50.96 190.5,54.5 199,54.5 201.5,52 201.5,44.02 C20.2
  Top 0.635: 26.67,6.35 25.4,6.35 | 25.4,6.35 20.32,6.35 Q3.S | Q4.S 25.4,15.24 25.4,6.35 | 26.67,6.35 29.21,6.89 LED2.K | 26.67,6.35 R5.2
  Bottom 0.381: 102.87,11.94 102.87,12.95 IC3.13 | 102.87,11.94 110.74,11.94 111.76,12.95 IC3.20 | 102.87,11.94 102.11,11.18 84.07,11.18 C27.2 | R20.2 129.54,5.08 139.7,5.08 R17.2
  Bottom 0.508: C4.2 59.69,11.43 S1.1 | C27.2 77.47,11.43 JP2.6 67.31,12.7 66.04,11.43 S1.2 | SERIAL.2 73.66,6.35 C25.2 | JP27.3 JP28.3 | JP29.3 JP22.2 | C2.2 45.72,44.45 IC1.GND | C6.2 LED1.K C9.2 | C10.2 64.77,48.26 JP24.2 | 33.02,6.35 X5.1 | C26.1 105.41,31.75 R16.2 | C18.1 185.42,35.56 R21.2 184.15,34.29 176.53,34.29 173.99,31.75 R22.2 | LED2.K 31.75,25.4 39.37,25.4 41.14,26.67 77.47,26.67 80.01,24.13 v97.79,24.13 | C17.2 148.59,6.35 C15.1 171.45,5.08 | 171.45,5.08 R28.2 | R14.2 144.78,31.75 C7.1 | C21.1 189.23,5.08 171.45,5.08
  Bottom 0.61: C21.1 193.31,3.81 C23.2
  Bottom 0.813: Q4.S 22.63,20.32 R4.2
  Bottom 2.184: 33.02,6.35 33.06,2.31 45.72,2.31 C3.-
  pour Bottom (isolate 2.184): 6,55.5 198,55.5 arc-90 203,50.5 203,5 arc-90 198,0 5,0 arc-90 0,5 0,50 0,50.5 arc-90 5,55.5
  pour Top (isolate 0.813): 5,55.5 198,55.5 arc-90 203,50.5 203,5 arc-90 198,0 5,0 arc-90 0,5 0,50 0,50.5 arc-90
LED1
  Top 0.508: LED1.A R11.1
N$1
  Top 0.813: JP7.1 XMOT.16
N$2
  Top 0.813: U$21.16 129.54,21.59 JP25.1
N$3
  Top 0.813: XMOT.13 132.08,43.18 JP7.2
N$4
  Top 0.813: JP7.3 XMOT.12
N$5
  Top 0.813: XMOT.9 137.16,43.18 JP7.4
N$6
  Bottom 0.508: U$46.22 166.37,19.05 JP5.7
N$7
  Top 0.508: JP1.7 XMOT.22
N$8
  Top 0.508: XMOT.25 116.84,43.18 JP1.3
N$9
  Top 0.508: JP1.1 114.3,40.64 119.38,40.64 XMOT.24
N$10
  Top 0.508: JP10.3 195.58,48.26 195.58,40.64 191.77,40.64 U$43.2
N$11
  Top 0.508: XMOT.1 149.86,43.18 JP3.1
N$12
  Top 0.508: JP5.5 U$46.23
N$13
  Top 0.813: U$21.13 132.08,15.24 132.08,21.59 JP25.2
N$14
  Top 0.813: U$21.12 134.62,21.59 JP25.3
N$15
  Top 0.508: R13.1 R14.1 133.35,31.75 135.89,34.29 XMOT.11
N$16  (via drill 0.61)
  Top 0.508: v132.08,33.02 XMOT.14 | R15.1 R16.1
  Bottom 0.508: v132.08,33.02 119.38,33.02 R15.1
N$17
  Bottom 0.813: U$21.9 138.43,17.78 137.16,19.05 137.16,21.59 JP25.4
N$18
  Top 0.508: JP9.7 U$43.22
N$19
  Top 0.508: C8.2 XMOT.7
N$20
  Top 0.508: JP4.7 U$21.22
N$21
  Top 0.508: U$21.25 116.84,15.24 JP4.3
N$22
  Top 0.508: JP4.1 114.3,12.7 119.38,12.7 U$21.24
N$23
  Top 0.508: U$43.23 163.83,43.18 JP9.5
N$24
  Top 0.508: JP8.3 195.58,20.32 195.58,12.7 191.77,12.7 U$46.2
N$25
  Top 0.508: JP5.3 U$46.25
N$26  (via drill 0.61)
  Top 0.508: v135.89,6.35 U$21.11 | R17.1 R18.1
  Bottom 0.508: R17.1 v135.89,6.35
N$27
  Top 0.508: U$21.14 132.08,10.16 129.54,7.62 129.54,2.54 118.11,2.54 R20.1 R19.1
N$28
  Top 0.508: U$21.7 142.24,15.24 C16.2
N$29
  Top 0.813: JP26.1 U$43.16
N$30
  Top 0.813: U$43.13 176.53,43.18 JP26.2
N$31
  Top 0.813: JP26.3 U$43.12
N$32
  Top 0.813: U$43.9 181.61,43.18 JP26.4
N$33
  Top 0.508: JP5.1 160.02,12.7 163.83,12.7 U$46.24
N$34
  Bottom 0.508: U$21.2 147.32,21.59 JP6.3
N$35
  Top 0.508: U$46.1 194.31,15.24 JP8.1
N$36
  Top 0.508: XMOT.2 147.32,44.45 148.59,45.72 148.59,48.26 JP3.3
N$37
  Top 0.508: U$21.23 119.38,15.24 JP4.5
N$38
  Top 0.508: XMOT.23 119.38,43.18 JP1.5
N$39
  Top 0.508: U$43.25 161.29,43.18 JP9.3
N$40
  Top 0.508: U$43.11 180.34,35.56 184.15,31.75 R22.1
  Bottom 0.508: R21.1 173.99,34.29 172.72,33.02 172.72,29.21 181.61,29.21 184.15,31.75 R22.1
N$41
  Top 0.508: U$43.14 176.53,31.75 173.99,29.21 161.29,29.21 R24.1 R23.1 161.29,34.29
N$42
  Top 0.508: C19.2 U$43.7
N$43
  Top 0.813: U$46.16 173.99,21.59 JP31.1
N$44
  Top 0.813: U$46.13 177.3,17.59 JP31.2
N$45
  Top 0.813: U$46.12 179.07,21.59 JP31.3
N$46
  Top 0.813: U$46.9 182.88,21.59 JP31.4
N$48
  Bottom 0.508: LED2.A 31.75,27.94 R1.1
N$50
  Top 0.508: SV1.5 IC2.16
N$51
  Top 0.508: SV1.4 IC2.17
N$52
  Top 0.508: SV1.3 IC2.18
N$53
  Top 0.508: SV1.2 IC2.19
N$54
  Top 0.508: U$46.11 180.34,8.89 176.53,5.08 | R26.1 176.53,5.08 | 176.53,5.08 R25.1
N$55
  Top 0.508: U$46.14 176.53,10.16 173.99,7.62 173.99,2.54 162.56,2.54 R28.1 R27.1
N$56
  Top 0.508: C22.2 U$46.7
N$57
  Top 0.635: 15.24,22.86 LED3.K
  Bottom 0.635: 15.24,22.86 LED3.K
  Bottom 1.93: X1.2 15.24,22.86 Q4.D
N$58
  Top 0.508: SV1.1 IC2.20
N$59
  Bottom 0.635: 20.32,8.89 Q3.D | 15.24,6.35 LED5.K
  Bottom 1.93: 20.32,8.89 17.78,8.89 15.24,6.35 10.16,6.35 7.62,8.89 X2.2
N$60
  Top 0.635: Q4.G R2.2
N$61
  Top 0.635: R3.2 24.13,11.43 20.32,11.43 Q3.G
N$63
  Top 0.508: IC2.22 102.87,35.56 102.87,41.91 SV2.4
N$64
  Top 0.635: LED3.A 15.24,20.32 13.97,21.59 13.97,24.13 15.24,25.4 R7.1
N$65
  Top 0.635: 15.24,8.89 LED5.A R29.1 15.24,12.7
N$66
  Top 0.635: Q1.D 45.72,29.21 46.99,27.94 R6.1
N$67
  Top 0.508: R30.2 43.18,29.21 Q1.G
N$68
  Top 0.508: C5.1 IC1.IN
  Bottom 0.889: IC1.IN 39.37,43.18 38.1,41.91 D3.C
N$69  (via drill 0.61 pad 1.42)
  Top 0.508: v101.6,39.37 IC2.23
  Bottom 0.508: v101.6,39.37 104.14,41.91 SV2.3
N$70
  Bottom 0.508: SERIAL.6 78.74,1.27 64.77,1.27 C1.1
N$71
  Top 0.508: SERIAL.3 71.12,6.35 JP38.2
N$72
  Bottom 1.93: 14.04,52 F2.1
  Bottom 2.184: K2.14 29.44,40.56 18,52 14.04,52
N$73  (via drill 0.61 pad 1.78)
  Top 0.889: v46.99,22.86 46.99,25.4 44.45,27.94 R6.2
  Bottom 0.889: v46.99,22.86 46.99,17.78 8.89,17.78 3.58,21.59 3.58,34.29 16.51,34.29 K2.A1
N$74
  Top 0.508: 38.1,6.35 X5.2
  Top 2.54: 38.1,6.35 43.18,11.43 F1.2
N$75
  Bottom 0.381: C12.2 90.93,14.48 107.7,14.48 107.7,13.21 IC3.17
N$76
  Top 0.508: JP6.1 U$21.1
N$77  (via drill 0.61)
  Top 0.381: v99.31,7.86 99.31,5.08 X4.1
  Bottom 0.381: v99.31,7.86 101.09,5.08 109.98,5.08 111.51,3.56 111.51,3.3 IC3.1
N$78  (via drill 0.61)
  Top 0.381: v108.71,14.73 100.08,7.1 100.08,5.08 X4.2
  Bottom 0.381: v108.71,14.73 108.71,13.21 108.97,13.21 IC3.18
N$79  (via drill 0.61)
  Top 0.381: v110.48,15.11 109.98,13.72 110.08,11.22 100.71,5.84 100.71,5.08 X4.3
  Bottom 0.381: v110.48,15.11 109.98,13.21 110.24,13.21 IC3.19
N$80
  Top 0.508: IC2.12 87.63,20.32 87.63,24.13 90.17,26.67 | C26.2 90.17,30.48 90.17,26.67 | 90.17,26.67 Q5.2
N$81
  Top 0.508: IC2.13 90.17,20.32 90.17,21.59 95.25,26.67 Q5.1
  Bottom 0.508: C24.2 100.33,26.67 Q5.1
N$82
  Bottom 0.381: IC3.2 110.49,3.05 110.49,1.78 112.01,1.78 112.27,2.03 112.27,8.89 87.88,8.89 87.76,9.02
  Bottom 0.508: C27.1 87.63,8.89 87.76,9.02 88.9,10.16 Q2.2
N$83
  Bottom 0.381: IC3.3 108.97,3.3 108.97,4.32 88.39,4.32 88.27,4.45
  Bottom 0.508: C25.1 87.63,3.81 88.27,4.45 88.9,5.08 Q2.1
PB5-MOSI
  Top 0.508: IC2.6 74.93,15.24 74.93,11.43 JP2.4
PB6-MISO
  Top 0.508: IC2.7 74.93,20.32 74.93,21.59 76.2,22.86 82.55,22.86 82.55,12.7 80.01,10.16 80.01,8.89 JP2.1
PB7-SCK
  Top 0.508: IC2.8 77.47,20.32 77.47,21.59 80.01,21.59 80.01,11.43 JP2.3
RELAY
  Top 0.508: R30.1 49.53,17.78 58.42,17.78 IC2.1
RELAY_POWER
  Bottom 0.508: 7.62,39.37 X3.2
  Bottom 1.016: D3.A 36.56,31.44 35.5,32.5 23.38,32.5 K2.11
  Bottom 2.184: K2.11 15.24,44.64 K2.A2
  Bottom 2.54: 7.62,39.37 8.89,40.64 K2.11
RXD  (via drill 0.61)
  Top 0.381: v82.8,2.54 82.55,2.79 82.55,5.08 81.79,5.84 77.47,5.84
  Top 0.508: v77.47,13.97 77.47,5.84 77.47,5.08 SERIAL.4
  Bottom 0.381: v82.8,2.54 99.57,2.54 100.08,3.05 IC3.10
  Bottom 0.508: IC2.14 90.17,17.78 81.28,17.78 v77.47,13.97
TXD
  Top 0.508: IC2.15 92.71,17.78 92.71,11.43 86.36,5.08 86.36,3.81 83.82,1.27 78.74,1.27 SERIAL.5
  Bottom 0.381: IC2.15 91.95,17.02 88.9,17.02 88.9,14.73 91.69,11.94 101.35,11.94 101.35,12.95 IC3.12
VMOT
  Top 0.508: 36.83,47.49 36.58,47.48
  Top 0.61: R1.2 35.56,31.75 35.56,45.72 36.58,47.48
  Top 1.93: C2.1 36.58,47.48 | F2.2 36.83,52.07 36.83,47.49
  Bottom 0.508: 127,11.43 U$21.18 | 171.45,11.43 U$46.18 | 144.78,8.89 C15.2 | 184.15,11.43 U$46.8 | 144.78,36.5 C7.2
  Bottom 1.93: 127,11.43 127,8.89 139.7,8.89 | 139.7,8.89 144.78,8.89 C17.1 171.45,8.89 | 139.7,8.89 U$21.8 | 171.45,8.89 171.45,11.43 | 184.78,9.53 181.61,8.89 171.45,8.89 | 184.78,9.53 184.15,11.43 | 190.5,8.89 184.15,8.89 184.78,9.53 | 190.5,8.89 195.58,8.89 198.12,11.43 C23.1 199.39,34 | C21.2 190.5,8.89 | XMOT.8 140,40.01 140,36.5 | 140,36.5 127,36.5 | 127,36.5 XMOT.18 | F2.2 24.2,52 107.5,52 109.5,50 109.5,42 111,36.51 126.5,36.51 127,36.5 | U$43.8 184.15,37.65 | 184.15,37.65 183,36.5 171.5,36.5 | 171.5,36.5 171.5,39.95 U$43.18 | 140,36.5 144.78,36.5 147.27,36.5 C11.1 153.57,36.5 171.5,36.5 | 184.15,37.65 185.87,37.65 C18.2 199.1,34.29 199.39,34 | C20.1 199.39,34
X-DIR
  Top 0.508: XMOT.21 123.19,50.8 120.65,52.07 72.39,52.07 72.39,38.1 IC2.36
X-STEP
  Top 0.508: XMOT.3 146.05,38.1 147.32,36.83 151.13,36.83 151.13,50.8 148.59,53.34 64.77,53.34 64.77,35.56 IC2.37
X-STOP  (via drill 0.61 pad 1.78)
  Top 0.508: v85.09,22.86 87.63,25.4 JP27.1
  Bottom 0.508: IC2.3 63.5,22.86 v85.09,22.86
Y-DIR  (via drill 0.61 pad 1.42)
  Top 0.508: U$21.21 123.19,20.32 107.95,20.32 v107.95,40.64
  Bottom 0.508: v107.95,40.64 107.95,43.18 99.06,43.18 92.71,36.83 88.9,36.83 87.63,35.56 | IC2.29 87.63,35.56 | IC2.33 77.47,35.56 87.63,35.56
Y-STEP  (via drill 0.61 pad 1.78)
  Top 0.508: U$21.3 147.32,15.24 v147.32,27.17
  Bottom 0.508: v147.32,27.17 146.05,27.94 85.09,27.94 81.28,31.75 74.93,31.75 73.66,33.02 IC2.34
Y-STOP
  Bottom 0.508: IC2.38 66.04,36.83 87.63,36.83 93.98,43.18 JP28.1
Z-DIR  (via drill 0.61 pad 1.42)
  Top 0.508: v111.76,49.03 99.06,49.03 99.06,41.91 IC2.27
  Bottom 0.508: U$43.21 167.64,52.07 114.3,52.07 113.03,50.8 113.03,49.53 v111.76,49.03
Z-STEP  (via drill 0.61 pad 1.42)
  Top 0.508: v111.76,50.8 90.17,50.8 90.17,35.56 IC2.28
  Bottom 0.508: U$43.3 188.5,53.34 114.3,53.34 v111.76,50.8
Z-STOP
  Top 0.508: IC2.2 62.23,20.32 62.23,21.59 67.31,26.67 74.93,26.67 74.93,39.37 JP29.1